# Altium project STSPIN32F0A_ESC.PrjPcb
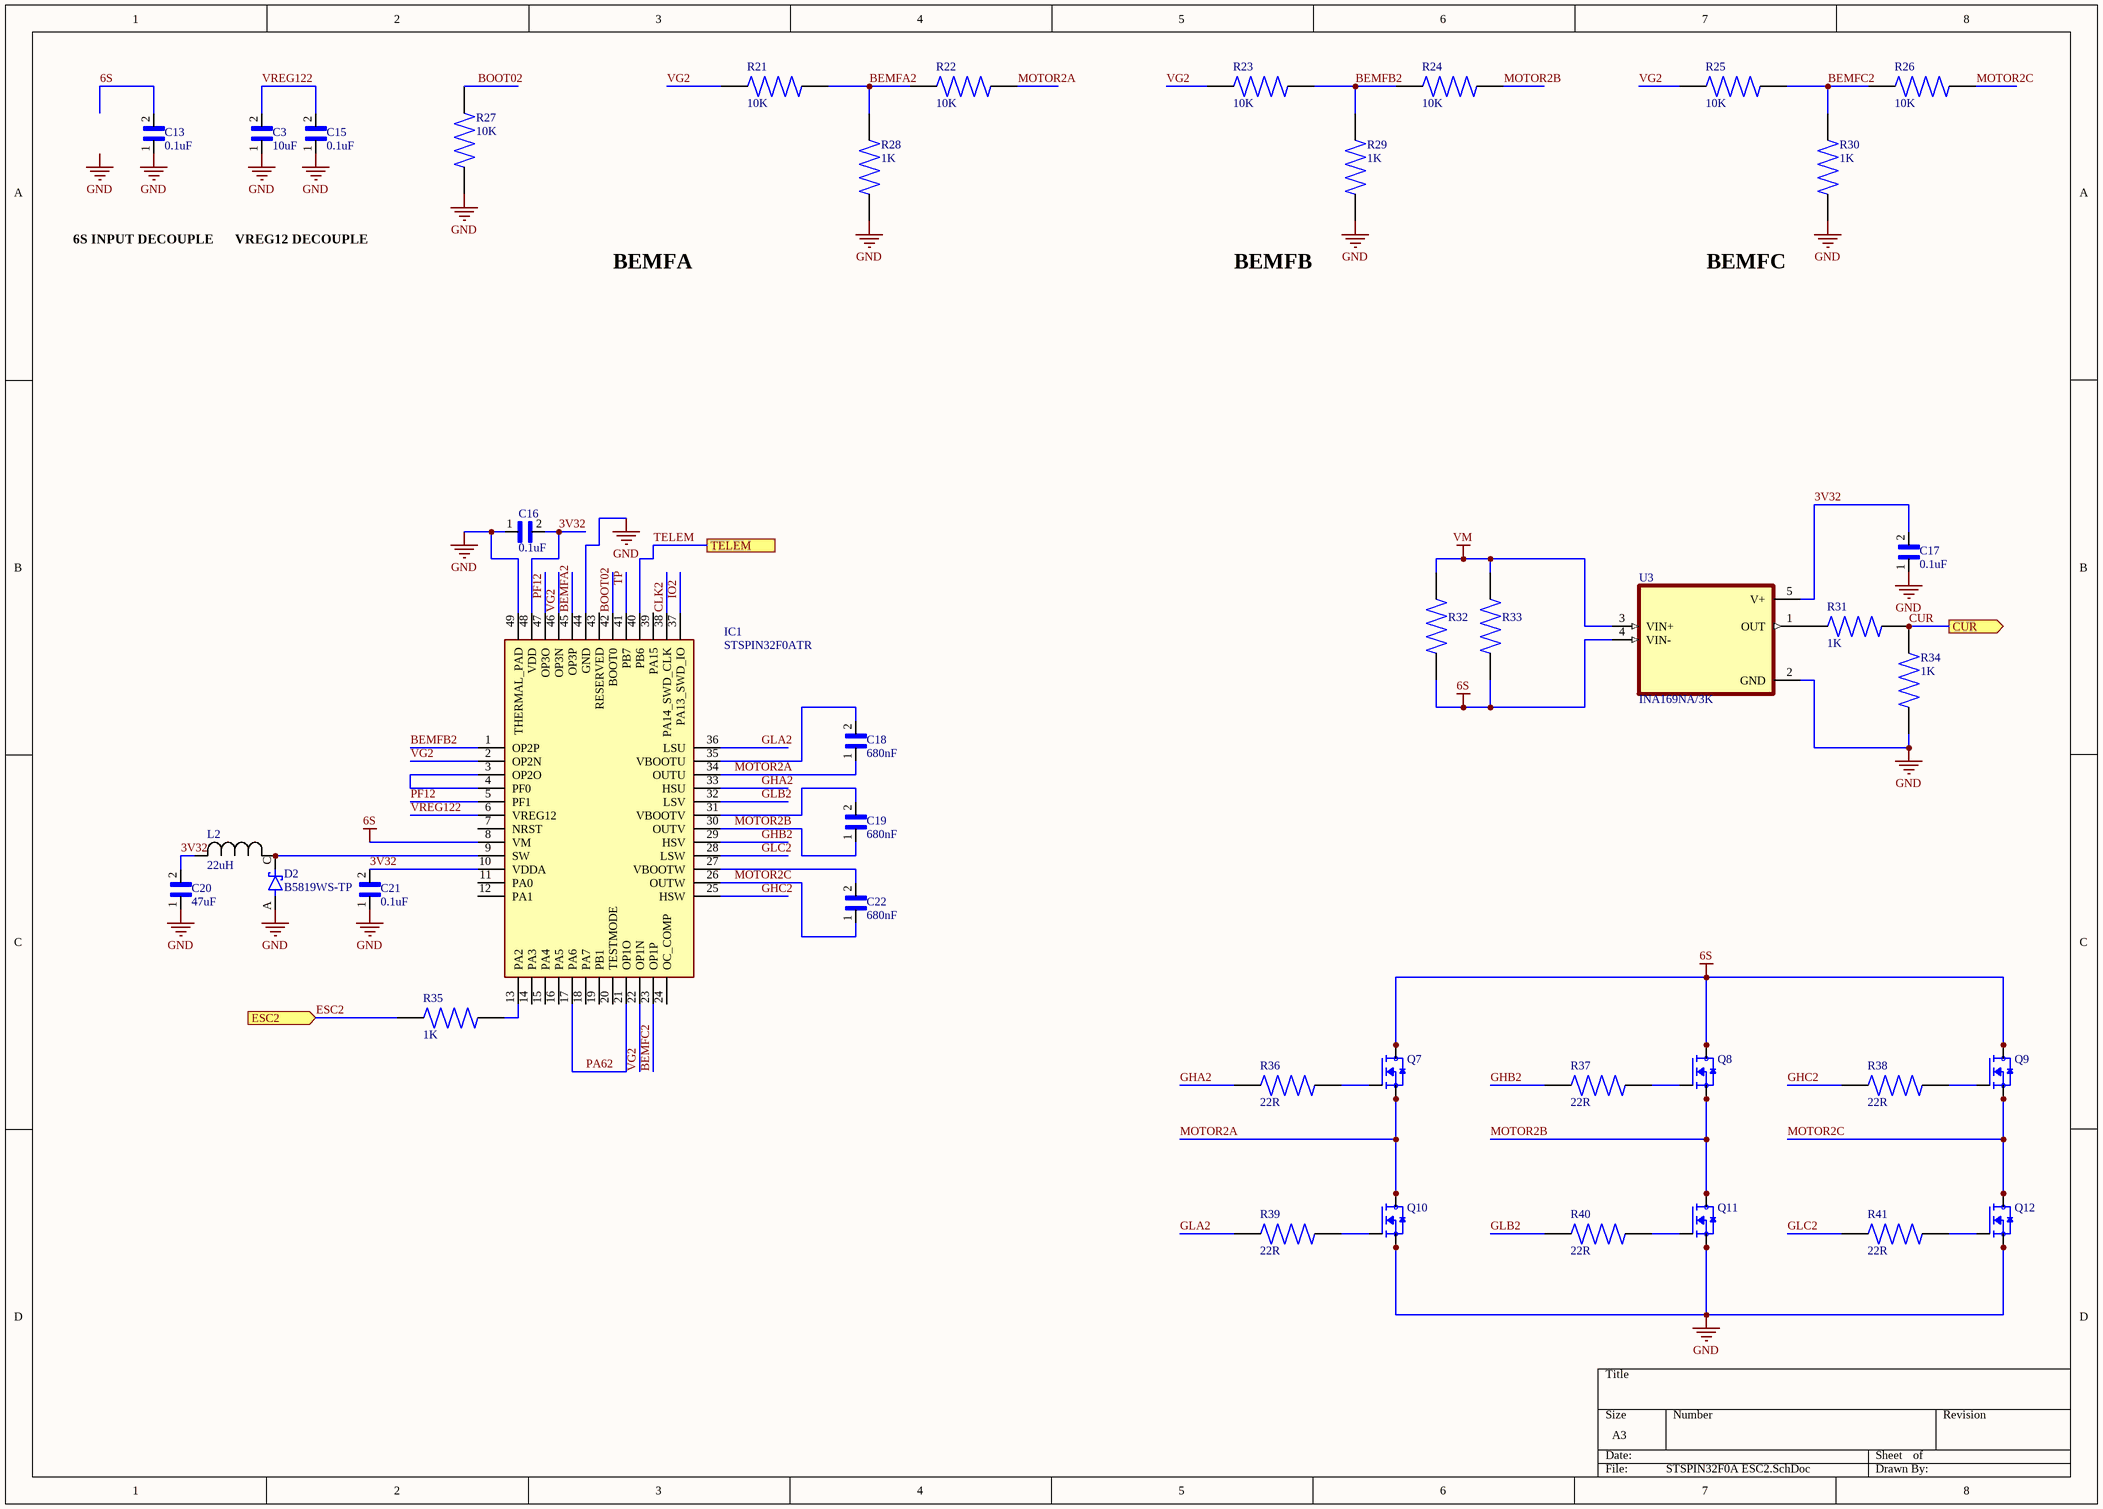
[diagram p0: STSPIN32F0A ESC2.SchDoc]
4 sheets, 168 parts. Net scope: flat (ports and power ports of the same name join across sheets).
Board files: STSPIN 4 IN 1 ESC.PcbDoc, ESC ITERATION 2.PcbDoc
Sheets:
  STSPIN32F0A ESC2.SchDoc
  STSPIN32F0A ESC3.SchDoc
  STSPIN32F0A ESC4.SchDoc
  STSPIN32F0A ESC5.SchDoc

## Sheet STSPIN32F0A ESC2.SchDoc
size A3

### Parts
C3  10uF  [CAPC1608X90N]
C13  0.1uF  [CAPC1005X55N]
C15  0.1uF  [CAPC1005X55N]
C16  0.1uF  [CAPC1005X55N]
C17  0.1uF  [CAPC1005X55N]
C18  680nF  [CAPC1005X55N]
C19  680nF  [CAPC1005X55N]
C20  47uF  [CAPC1608X90N]
C21  0.1uF  [CAPC1005X55N]
C22  680nF  [CAPC1005X55N]
D2  B5819WS-TP  [SOD2512X115N]
IC1  STSPIN32F0ATR  [QFN50P700X700X100-49N-D]
L2  22uH  [IND_BOURNS_SRN3015]
Q7  TPHR8504PL,L1Q  [TRANS_TPHR8504PL,L1Q]  (value not drawn)
Q8  TPHR8504PL,L1Q  [TRANS_TPHR8504PL,L1Q]  (value not drawn)
Q9  TPHR8504PL,L1Q  [TRANS_TPHR8504PL,L1Q]  (value not drawn)
Q10  TPHR8504PL,L1Q  [TRANS_TPHR8504PL,L1Q]  (value not drawn)
Q11  TPHR8504PL,L1Q  [TRANS_TPHR8504PL,L1Q]  (value not drawn)
Q12  TPHR8504PL,L1Q  [TRANS_TPHR8504PL,L1Q]  (value not drawn)
R21  10K  [RESC1005X37N]
R22  10K  [RESC1005X37N]
R23  10K  [RESC1005X37N]
R24  10K  [RESC1005X37N]
R25  10K  [RESC1005X37N]
R26  10K  [RESC1005X37N]
R27  10K  [RESC1005X37N]
R28  1K  [RESC1005X37N]
R29  1K  [RESC1005X37N]
R30  1K  [RESC1005X37N]
R31  1K  [RESC1005X37N]
R32  CSSH2512JTL500  [RESC6232X104N]  (value not drawn)
R33  CSSH2512JTL500  [RESC6232X104N]  (value not drawn)
R34  1K  [RESC1005X37N]
R35  1K  [RESC1005X37N]
R36  22R  [RESC1005X37N]
R37  22R  [RESC1005X37N]
R38  22R  [RESC1005X37N]
R39  22R  [RESC1005X37N]
R40  22R  [RESC1005X37N]
R41  22R  [RESC1005X37N]
U3  INA169NA/3K  [SOT95P280X145-5N]

### Ports
CUR (out), ESC2 (in), TELEM

### Nets
6S: C13.2 IC1.8(VM) Q7.5(D) Q7.6(D) Q7.7(D) Q7.8(D) Q7.9(D) Q8.5(D) Q8.6(D) Q8.7(D) Q8.8(D) Q8.9(D) Q9.5(D) Q9.6(D) Q9.7(D) Q9.8(D) Q9.9(D) R32.2 R33.2 U3.4(VIN-)
GND: C3.1 C13.1 C15.1 C16.1 C17.1 C20.1 C21.1 D2.A IC1.44(GND) IC1.49(THERMAL_PAD) Q10.1(S) Q10.2(S) Q10.3(S) Q11.1(S) Q11.2(S) Q11.3(S) Q12.1(S) Q12.2(S) Q12.3(S) R27.1 R28.2 R29.2 R30.2 R34.2 U3.2(GND)
VM: R32.1 R33.1 U3.3(VIN+)
3V32: C16.2 C17.2 C20.2 C21.2 IC1.10(VDDA) IC1.48(VDD) L2.2 U3.5(V+)
BEMFA2: IC1.45(OP3P) R21.1 R22.2 R28.1
BEMFB2: IC1.1(OP2P) R23.1 R24.2 R29.1
BEMFC2: IC1.23(OP1P) R25.1 R26.2 R30.1
BOOT02: IC1.42(BOOT0) R27.2
CLK2: IC1.38(PA14_SWD_CLK)
CUR: R31.2 R34.1 ; port CUR
ESC2: R35.1 ; port ESC2
GHA2: IC1.33(HSU) R36.2
GHB2: IC1.29(HSV) R37.2
GHC2: IC1.25(HSW) R38.2
GLA2: IC1.36(LSU) R39.2
GLB2: IC1.32(LSV) R40.2
GLC2: IC1.28(LSW) R41.2
IO2: IC1.37(PA13_SWD_IO)
MOTOR2A: C18.1 IC1.34(OUTU) Q7.1(S) Q7.2(S) Q7.3(S) Q10.5(D) Q10.6(D) Q10.7(D) Q10.8(D) Q10.9(D) R22.1
MOTOR2B: C19.1 IC1.30(OUTV) Q8.1(S) Q8.2(S) Q8.3(S) Q11.5(D) Q11.6(D) Q11.7(D) Q11.8(D) Q11.9(D) R24.1
MOTOR2C: C22.1 IC1.26(OUTW) Q9.1(S) Q9.2(S) Q9.3(S) Q12.5(D) Q12.6(D) Q12.7(D) Q12.8(D) Q12.9(D) R26.1
PA62: IC1.17(PA6) IC1.21(OP1O)
PF12: IC1.5(PF1) IC1.47(OP3O)
TELEM: IC1.40(PB6) ; port TELEM
TP: IC1.41(PB7)
VG2: IC1.2(OP2N) IC1.22(OP1N) IC1.46(OP3N) R21.2 R23.2 R25.2
VREG122: C3.2 C15.2 IC1.6(VREG12)
NetC18_2: C18.2 IC1.35(VBOOTU)
NetC19_2: C19.2 IC1.31(VBOOTV)
NetC22_2: C22.2 IC1.27(VBOOTW)
NetD2_C: D2.C(K) IC1.9(SW) L2.1
NetIC1_3: IC1.3(OP2O) IC1.4(PF0)
NetIC1_13: IC1.13(PA2) R35.2
NetQ7_4: Q7.4(G) R36.1
NetQ8_4: Q8.4(G) R37.1
NetQ9_4: Q9.4(G) R38.1
NetQ10_4: Q10.4(G) R39.1
NetQ11_4: Q11.4(G) R40.1
NetQ12_4: Q12.4(G) R41.1
NetR31_1: R31.1 U3.1(OUT)

Not connected (* = marked no-connect by the designer): IC1 7(NRST) 11(PA0) 12(PA1) 14(PA3) 15(PA4) 16(PA5) 18(PA7) 19(PB1) 20(TESTMODE) 24(OC_COMP) 39(PA15) 43(RESERVED)

### Notes on the sheet
- 6S INPUT DECOUPLE
- VREG12 DECOUPLE
- BEMFA
- BEMFB
- BEMFC
- Labels drawn without touching a wire or pin: GND

### Library data of the parts
C3 C20 = GRM188R71E224JA88D: SMD Capacitor X7R(EIA) with Capacitance: 0.22uF Tol. 5%. Rated Voltage: 25Vdc; Package: None; Price: None; Value: *; MP: GRM188R71E224JA88D; Availability: Unavailable
C13 C15-C19 C21 C22 = GRM1555C1H222JA01D: Package: None; Price: None; Value: *; MP: GRM1555C1H222JA01D; Availability: Unavailable
D2 = B5819WS-TP: MF: {'manufacturer': u'Micro Commercial Components'}; Package: None; MP: B5819WS-TP; Price: None; Availability: Unavailable; Value: *
IC1 = STSPIN32F0ATR: Integrated Circuit; Manufacturer_Name: STMicroelectronics; Datasheet Link: http://www.st.com/content/ccc/resource/technical/document/datasheet/group3/3d/88/0f/d1/3f/0c/49/80/DM00406030/files/DM00406030.pdf/jcr:content/translations/en.DM00406030.pdf; Height: 1mm; Manufacturer_Part_Number: STSPIN32F0ATR; Mouser Part Number: 511-STSPIN32F0ATR; Mouser Price/Stock: https://www.mouser.co.uk/ProductDetail/STMicroelectronics/STSPIN32F0ATR?qs=1mbolxNpo8flc7yUpKWOVQ%3D%3D; Arrow Part Number: STSPIN32F0ATR; Arrow Price/Stock: https://www.arrow.com/en/products/stspin32f0atr/stmicroelectronics
L2 = SRN3015-220M: No Description Available; Mfr_Name: Bourns Electronics; Type: DEV; Copyright: Copyright (C) 2022 Ultra Librarian. All rights reserved.; Manufacturer_Part_Number: SRN3015-220M; Digi-Key_Part_Number_1: SRN3015-220MCT-ND; Digi-Key_Part_Number_2: SRN3015-220MDKR-ND; Digi-Key_Part_Number_3: SRN3015-220MTR-ND; RefDes: RefDes
Q7-Q12 = TPHR8504PL,L1Q: N-Channel 40V 150A (Tc) 1W (Ta), 170W (Tc) Surface Mount 8-SOP Advance (5x5); MF: Toshiba Semiconductor; Package: SOP-8 Toshiba; Price: None; Value: *; MP: TPHR8504PL,L1Q; SnapEDA_Link: https://www.snapeda.com/parts/TPHR8504PL,L1Q/Toshiba%20Semiconductor%20and%20Storage/view-part/604439/?ref=snap; Availability: Unavailable
R21-R31 R34-R41 = RE0402BRE07330KL: MF: {'manufacturer': u'Yageo'}; Availability: Unavailable; Package: None; MP: RE0402BRE07330KL; Value: *; Price: None
R32 R33 = CSSH2512JTL500: MF: {'manufacturer': u'Stackpole Electronics Inc'}; Price: None; MP: CSSH2512JTL500; Package: None; Value: *; Availability: Unavailable
U3 = INA169NA/3K: MF: {'manufacturer': u'Texas Instruments'}; Availability: Unavailable; MP: INA169NA/3K; Value: *; Package: None; Price: None

## Sheet STSPIN32F0A ESC3.SchDoc
size A3
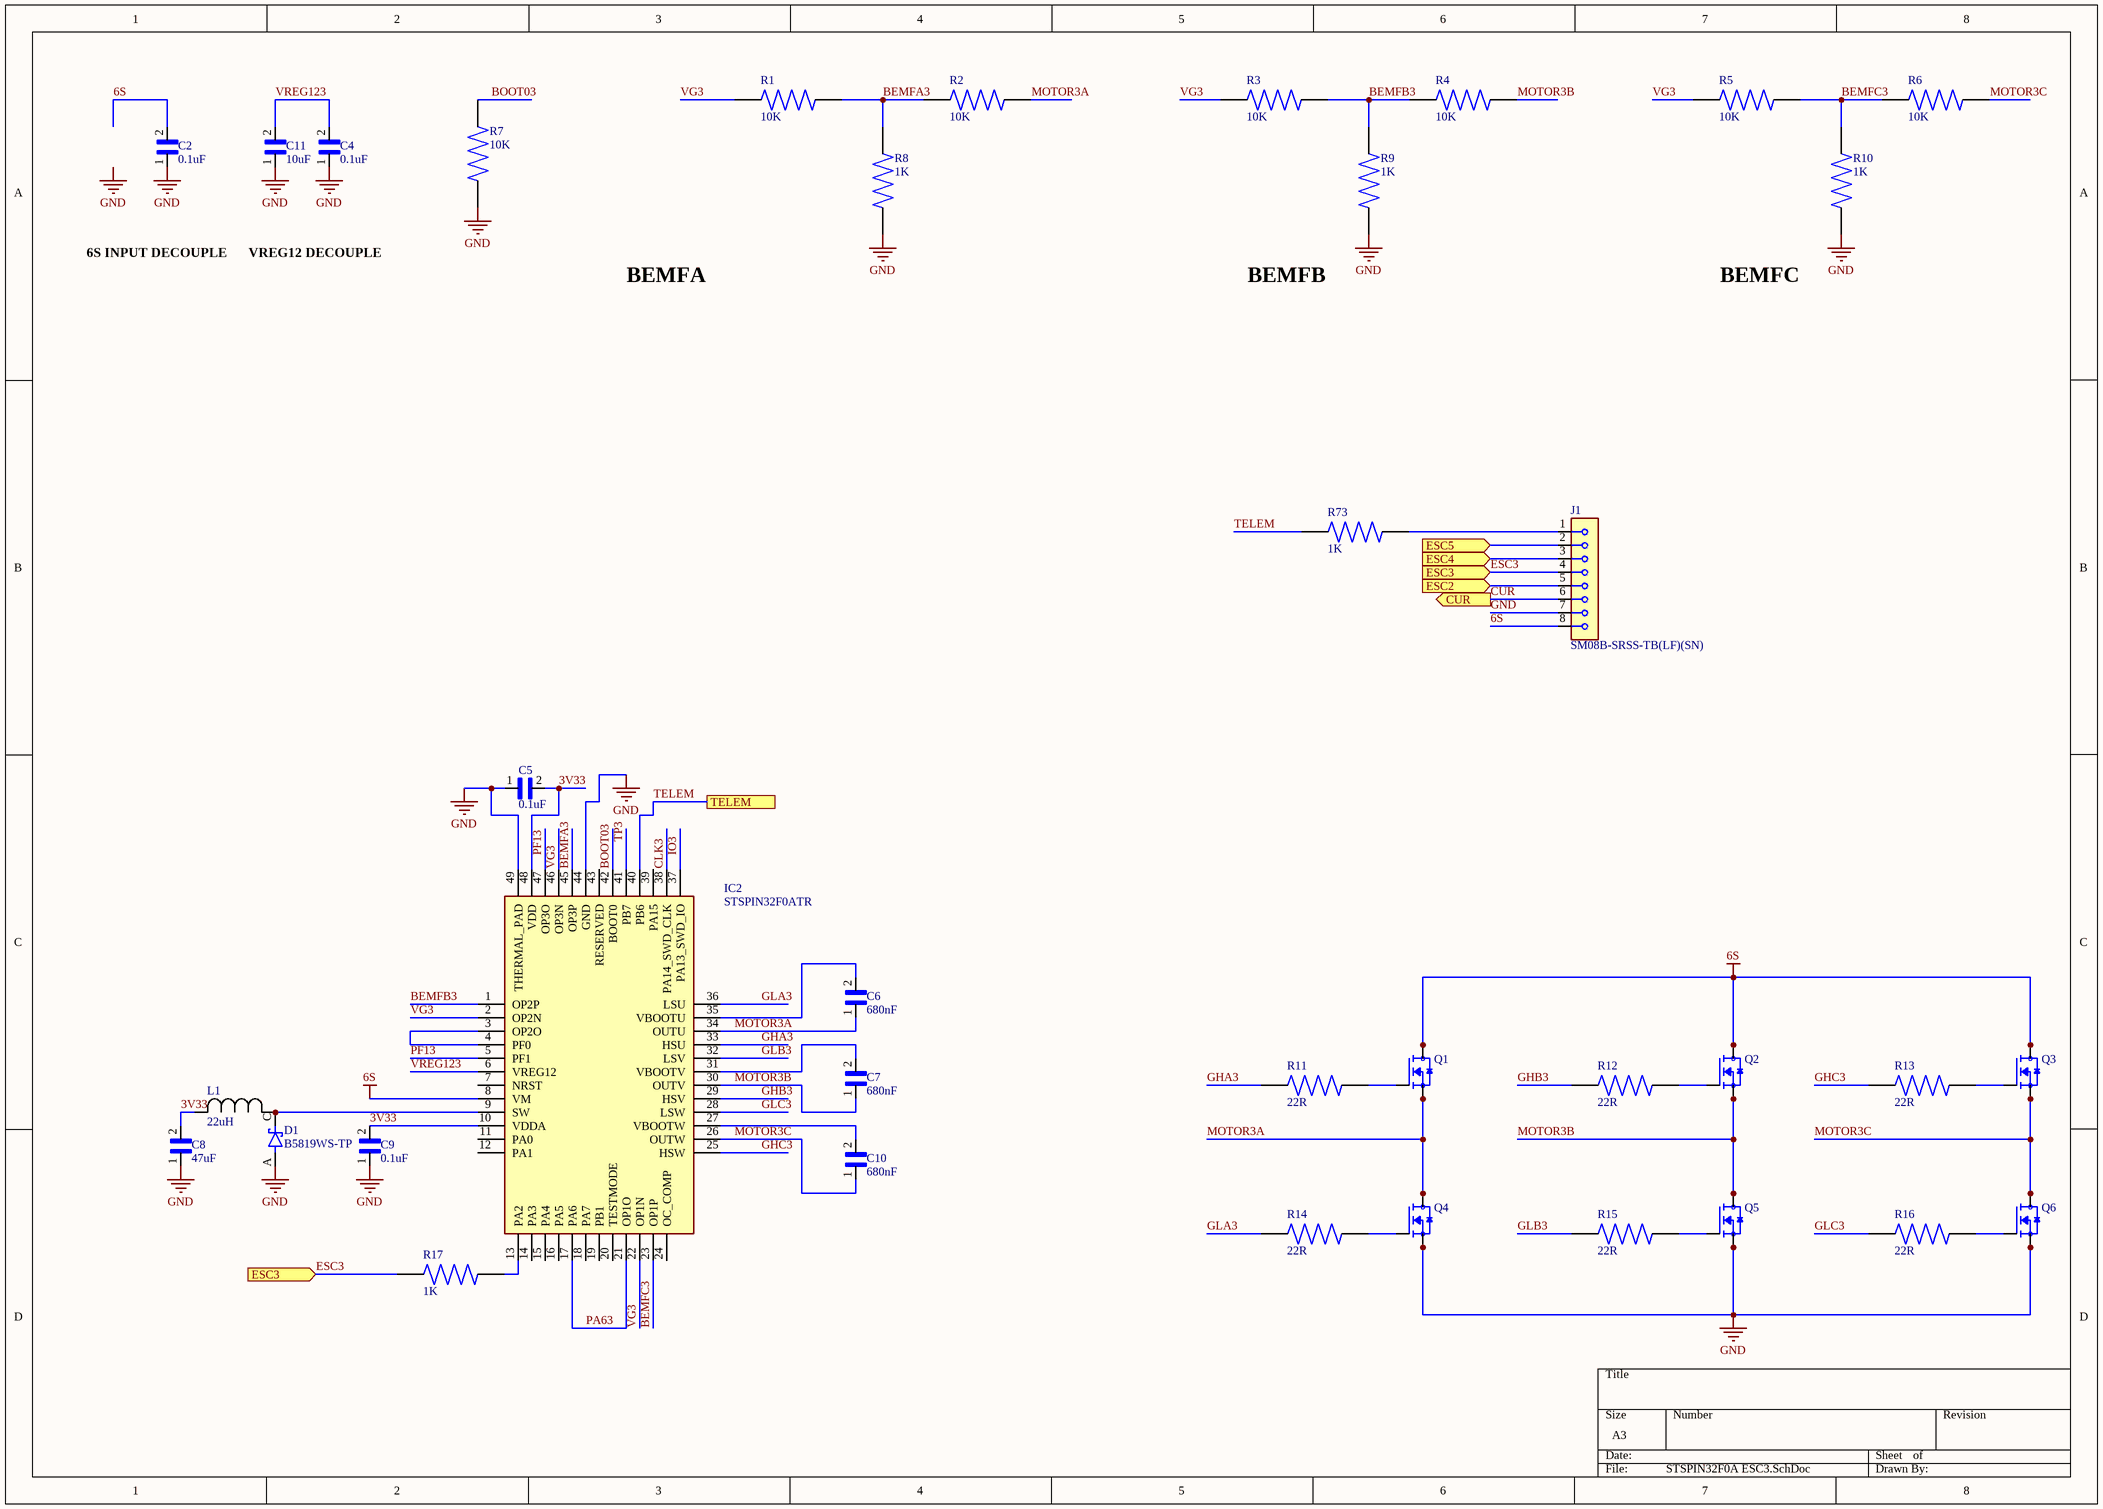
[diagram p1: STSPIN32F0A ESC3.SchDoc]

### Parts
C2  0.1uF  [CAPC1005X55N]
C4  0.1uF  [CAPC1005X55N]
C5  0.1uF  [CAPC1005X55N]
C6  680nF  [CAPC1005X55N]
C7  680nF  [CAPC1005X55N]
C8  47uF  [CAPC1608X90N]
C9  0.1uF  [CAPC1005X55N]
C10  680nF  [CAPC1005X55N]
C11  10uF  [CAPC1608X90N]
D1  B5819WS-TP  [SOD2512X115N]
IC2  STSPIN32F0ATR  [QFN50P700X700X100-49N-D]
J1  SM08B-SRSS-TB(LF)(SN)  [JST_SM08B-SRSS-TB(LF)(SN)]
L1  22uH  [IND_BOURNS_SRN3015]
Q1  TPHR8504PL,L1Q  [TRANS_TPHR8504PL,L1Q]  (value not drawn)
Q2  TPHR8504PL,L1Q  [TRANS_TPHR8504PL,L1Q]  (value not drawn)
Q3  TPHR8504PL,L1Q  [TRANS_TPHR8504PL,L1Q]  (value not drawn)
Q4  TPHR8504PL,L1Q  [TRANS_TPHR8504PL,L1Q]  (value not drawn)
Q5  TPHR8504PL,L1Q  [TRANS_TPHR8504PL,L1Q]  (value not drawn)
Q6  TPHR8504PL,L1Q  [TRANS_TPHR8504PL,L1Q]  (value not drawn)
R1  10K  [RESC1005X37N]
R2  10K  [RESC1005X37N]
R3  10K  [RESC1005X37N]
R4  10K  [RESC1005X37N]
R5  10K  [RESC1005X37N]
R6  10K  [RESC1005X37N]
R7  10K  [RESC1005X37N]
R8  1K  [RESC1005X37N]
R9  1K  [RESC1005X37N]
R10  1K  [RESC1005X37N]
R11  22R  [RESC1005X37N]
R12  22R  [RESC1005X37N]
R13  22R  [RESC1005X37N]
R14  22R  [RESC1005X37N]
R15  22R  [RESC1005X37N]
R16  22R  [RESC1005X37N]
R17  1K  [RESC1005X37N]
R73  1K  [RESC1005X37N]

### Ports
CUR (out), ESC2 (in), ESC3 (in), ESC4 (in), ESC5 (in), TELEM

### Nets
6S: C2.2 IC2.8(VM) J1.8 Q1.5(D) Q1.6(D) Q1.7(D) Q1.8(D) Q1.9(D) Q2.5(D) Q2.6(D) Q2.7(D) Q2.8(D) Q2.9(D) Q3.5(D) Q3.6(D) Q3.7(D) Q3.8(D) Q3.9(D)
GND: C2.1 C4.1 C5.1 C8.1 C9.1 C11.1 D1.A IC2.44(GND) IC2.49(THERMAL_PAD) J1.7 Q4.1(S) Q4.2(S) Q4.3(S) Q5.1(S) Q5.2(S) Q5.3(S) Q6.1(S) Q6.2(S) Q6.3(S) R7.1 R8.2 R9.2 R10.2
3V33: C5.2 C8.2 C9.2 IC2.10(VDDA) IC2.48(VDD) L1.2
BEMFA3: IC2.45(OP3P) R1.1 R2.2 R8.1
BEMFB3: IC2.1(OP2P) R3.1 R4.2 R9.1
BEMFC3: IC2.23(OP1P) R5.1 R6.2 R10.1
BOOT03: IC2.42(BOOT0) R7.2
CLK3: IC2.38(PA14_SWD_CLK)
CUR: J1.6 ; port CUR
ESC2: J1.5 ; port ESC2
ESC3: J1.4 R17.1 ; port ESC3
ESC4: J1.3 ; port ESC4
ESC5: J1.2 ; port ESC5
GHA3: IC2.33(HSU) R11.2
GHB3: IC2.29(HSV) R12.2
GHC3: IC2.25(HSW) R13.2
GLA3: IC2.36(LSU) R14.2
GLB3: IC2.32(LSV) R15.2
GLC3: IC2.28(LSW) R16.2
IO3: IC2.37(PA13_SWD_IO)
MOTOR3A: C6.1 IC2.34(OUTU) Q1.1(S) Q1.2(S) Q1.3(S) Q4.5(D) Q4.6(D) Q4.7(D) Q4.8(D) Q4.9(D) R2.1
MOTOR3B: C7.1 IC2.30(OUTV) Q2.1(S) Q2.2(S) Q2.3(S) Q5.5(D) Q5.6(D) Q5.7(D) Q5.8(D) Q5.9(D) R4.1
MOTOR3C: C10.1 IC2.26(OUTW) Q3.1(S) Q3.2(S) Q3.3(S) Q6.5(D) Q6.6(D) Q6.7(D) Q6.8(D) Q6.9(D) R6.1
PA63: IC2.17(PA6) IC2.21(OP1O)
PF13: IC2.5(PF1) IC2.47(OP3O)
TELEM: IC2.40(PB6) R73.1 ; port TELEM
TP3: IC2.41(PB7)
VG3: IC2.2(OP2N) IC2.22(OP1N) IC2.46(OP3N) R1.2 R3.2 R5.2
VREG123: C4.2 C11.2 IC2.6(VREG12)
NetC6_2: C6.2 IC2.35(VBOOTU)
NetC7_2: C7.2 IC2.31(VBOOTV)
NetC10_2: C10.2 IC2.27(VBOOTW)
NetD1_C: D1.C(K) IC2.9(SW) L1.1
NetIC2_3: IC2.3(OP2O) IC2.4(PF0)
NetIC2_13: IC2.13(PA2) R17.2
NetJ1_1: J1.1 R73.2
NetQ1_4: Q1.4(G) R11.1
NetQ2_4: Q2.4(G) R12.1
NetQ3_4: Q3.4(G) R13.1
NetQ4_4: Q4.4(G) R14.1
NetQ5_4: Q5.4(G) R15.1
NetQ6_4: Q6.4(G) R16.1

Not connected (* = marked no-connect by the designer): IC2 7(NRST) 11(PA0) 12(PA1) 14(PA3) 15(PA4) 16(PA5) 18(PA7) 19(PB1) 20(TESTMODE) 24(OC_COMP) 39(PA15) 43(RESERVED)

### Notes on the sheet
- 6S INPUT DECOUPLE
- VREG12 DECOUPLE
- BEMFA
- BEMFB
- BEMFC
- Labels drawn without touching a wire or pin: GND

### Library data of the parts
C2 C4-C7 C9 C10 = GRM1555C1H222JA01D: Package: None; Price: None; Value: *; MP: GRM1555C1H222JA01D; Availability: Unavailable
C8 C11 = GRM188R71E224JA88D: as C3 on sheet STSPIN32F0A ESC2; Package: None; Price: None; Value: *; MP: GRM188R71E224JA88D; Availability: Unavailable
D1 = B5819WS-TP: as D2 on sheet STSPIN32F0A ESC2; Package: None; MP: B5819WS-TP; Price: None; Availability: Unavailable; Value: *
IC2 = STSPIN32F0ATR: as IC1 on sheet STSPIN32F0A ESC2; Datasheet Link: http://www.st.com/content/ccc/resource/technical/document/datasheet/group3/3d/88/0f/d1/3f/0c/49/80/DM00406030/files/DM00406030.pdf/jcr:content/translations/en.DM00406030.pdf; Height: 1mm; Manufacturer_Part_Number: STSPIN32F0ATR; Mouser Part Number: 511-STSPIN32F0ATR; Mouser Price/Stock: https://www.mouser.co.uk/ProductDetail/STMicroelectronics/STSPIN32F0ATR?qs=1mbolxNpo8flc7yUpKWOVQ%3D%3D; Arrow Part Number: STSPIN32F0ATR; Arrow Price/Stock: https://www.arrow.com/en/products/stspin32f0atr/stmicroelectronics
J1 = SM08B-SRSS-TB(LF)(SN): SH Series 8 Position 1 mm Pitch Surface Mount Side Entry Shrouded Header; Price: None; MP: SM08B-SRSS-TB(LF)(SN); Availability: Unavailable; Value: *; Package: None
L1 = SRN3015-220M: as L2 on sheet STSPIN32F0A ESC2; Copyright: Copyright (C) 2022 Ultra Librarian. All rights reserved.; Manufacturer_Part_Number: SRN3015-220M; Digi-Key_Part_Number_1: SRN3015-220MCT-ND; Digi-Key_Part_Number_2: SRN3015-220MDKR-ND; Digi-Key_Part_Number_3: SRN3015-220MTR-ND; RefDes: RefDes
Q1-Q6 = TPHR8504PL,L1Q: as Q7 on sheet STSPIN32F0A ESC2; Package: SOP-8 Toshiba; Price: None; Value: *; MP: TPHR8504PL,L1Q; SnapEDA_Link: https://www.snapeda.com/parts/TPHR8504PL,L1Q/Toshiba%20Semiconductor%20and%20Storage/view-part/604439/?ref=snap; Availability: Unavailable
R1-R17 R73 = RE0402BRE07330KL: MF: {'manufacturer': u'Yageo'}; Availability: Unavailable; Package: None; MP: RE0402BRE07330KL; Value: *; Price: None

## Sheet STSPIN32F0A ESC4.SchDoc
size A3
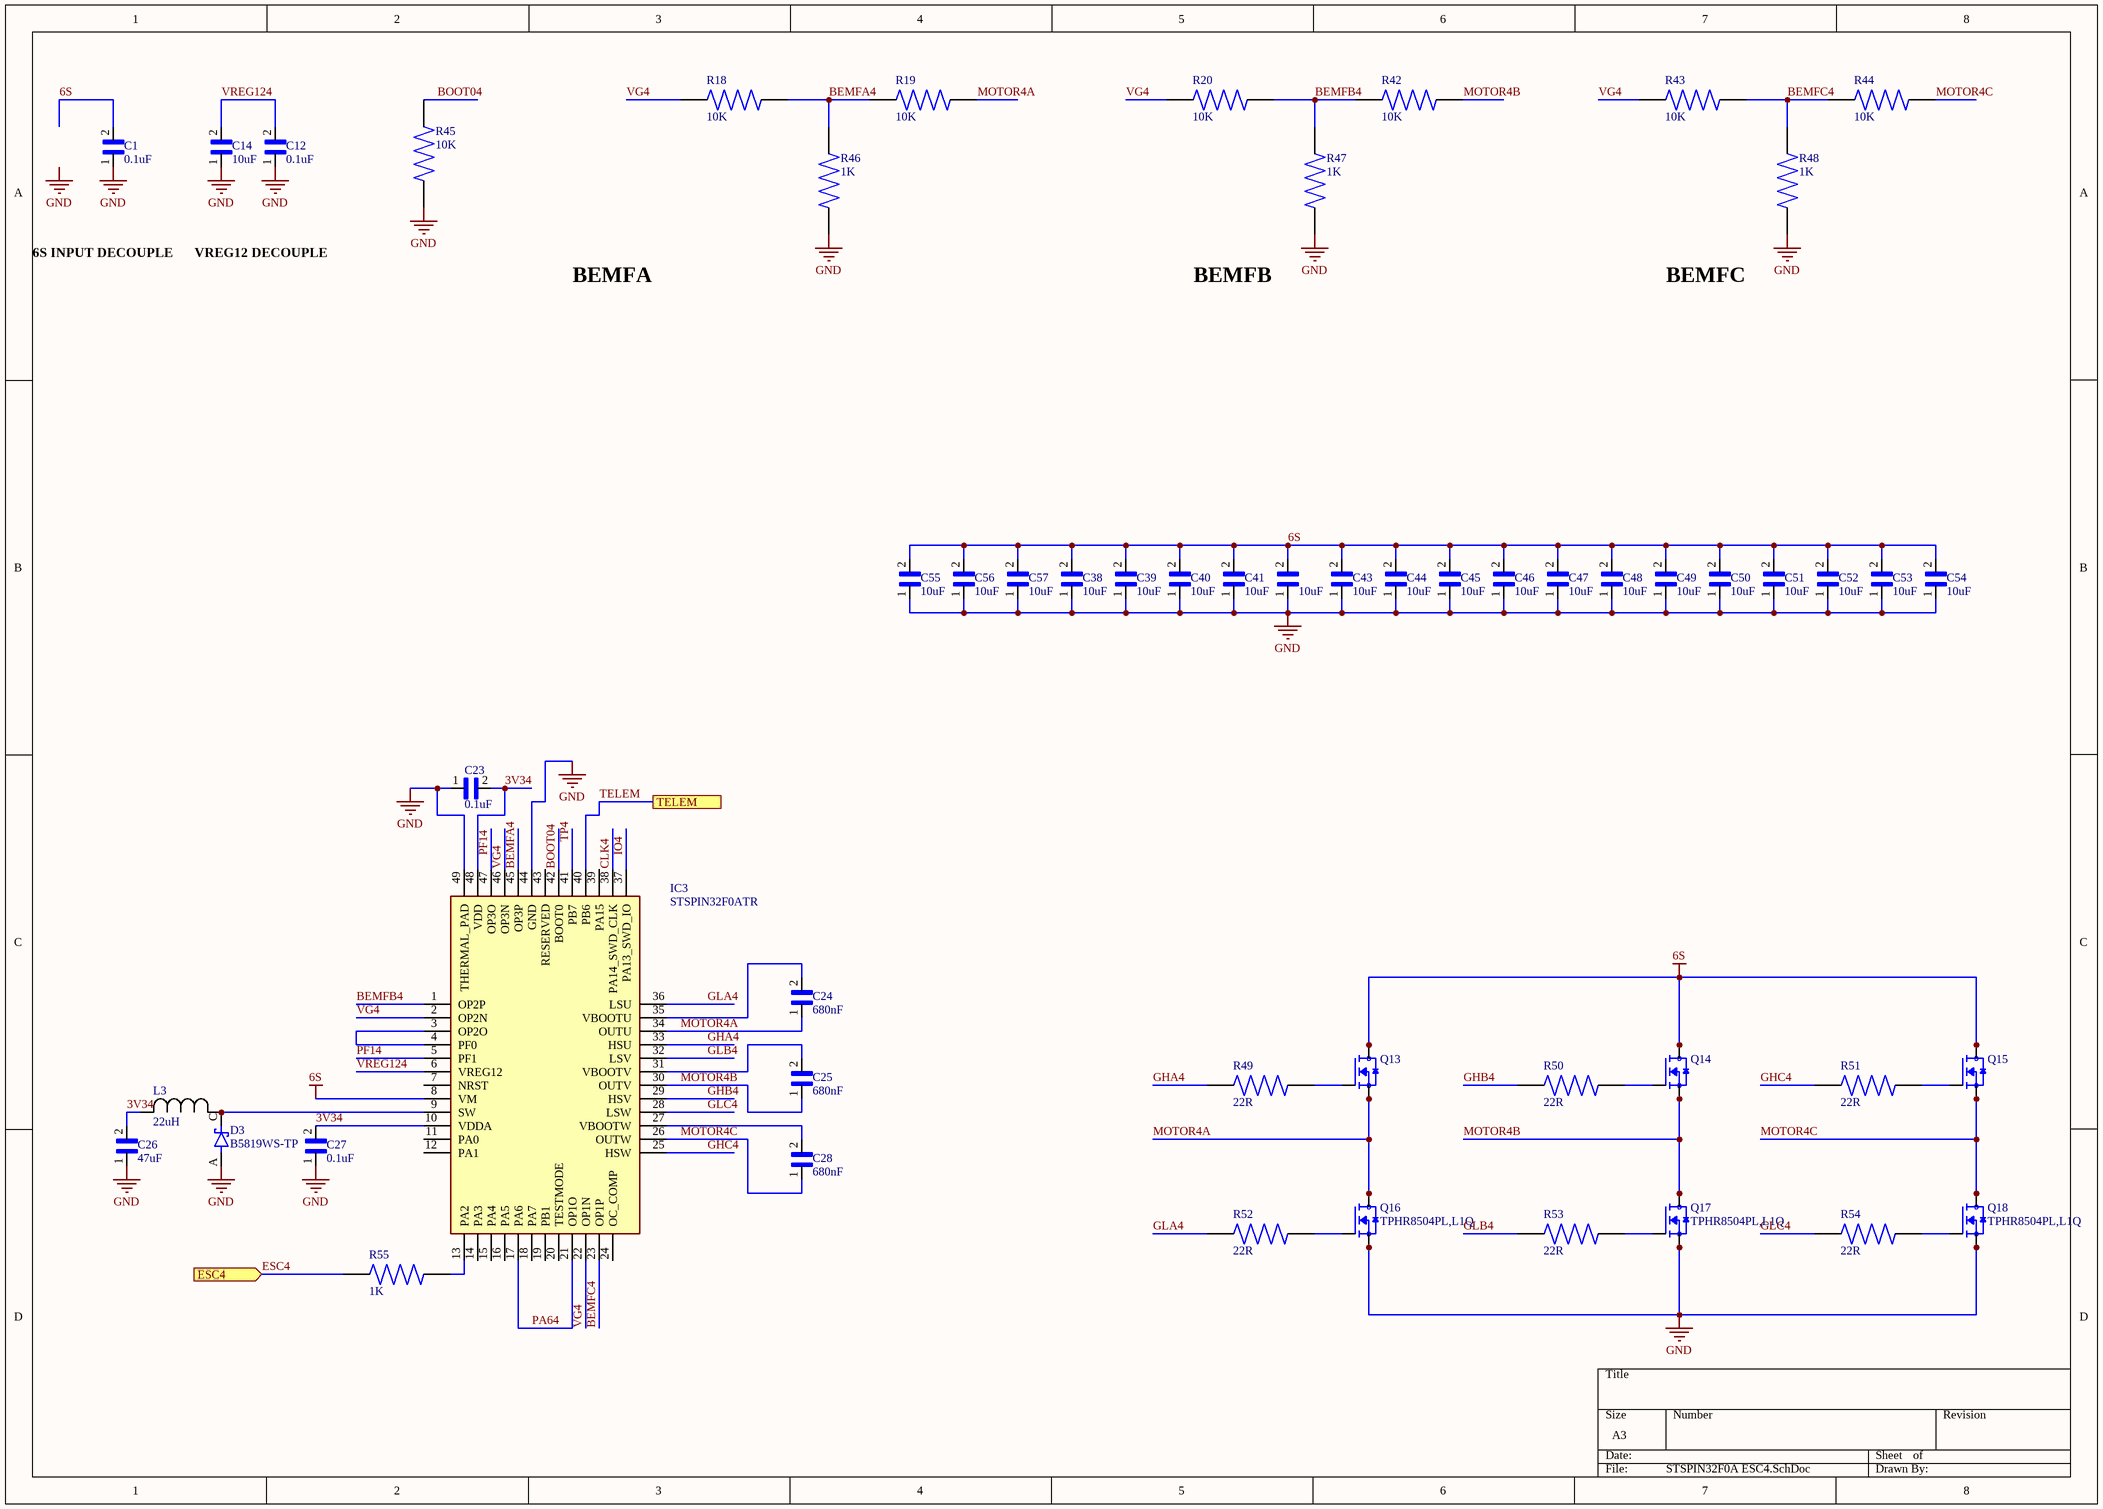
[diagram p2: STSPIN32F0A ESC4.SchDoc]

### Parts
C1  0.1uF  [CAPC1005X55N]
C12  0.1uF  [CAPC1005X55N]
C14  10uF  [CAPC1608X90N]
C23  0.1uF  [CAPC1005X55N]
C24  680nF  [CAPC1005X55N]
C25  680nF  [CAPC1005X55N]
C26  47uF  [CAPC1608X90N]
C27  0.1uF  [CAPC1005X55N]
C28  680nF  [CAPC1005X55N]
C38  10uF  [CAPC3216X190N]
C39  10uF  [CAPC3216X190N]
C40  10uF  [CAPC3216X190N]
C41  10uF  [CAPC3216X190N]
C42  10uF  [CAPC3216X190N]
C43  10uF  [CAPC3216X190N]
C44  10uF  [CAPC3216X190N]
C45  10uF  [CAPC3216X190N]
C46  10uF  [CAPC3216X190N]
C47  10uF  [CAPC3216X190N]
C48  10uF  [CAPC3216X190N]
C49  10uF  [CAPC3216X190N]
C50  10uF  [CAPC3216X190N]
C51  10uF  [CAPC3216X190N]
C52  10uF  [CAPC3216X190N]
C53  10uF  [CAPC3216X190N]
C54  10uF  [CAPC3216X190N]
C55  10uF  [CAPC3216X190N]
C56  10uF  [CAPC3216X190N]
C57  10uF  [CAPC3216X190N]
D3  B5819WS-TP  [SOD2512X115N]
IC3  STSPIN32F0ATR  [QFN50P700X700X100-49N-D]
L3  22uH  [IND_BOURNS_SRN3015]
Q13  TPHR8504PL,L1Q  [TRANS_TPHR8504PL,L1Q]  (value not drawn)
Q14  TPHR8504PL,L1Q  [TRANS_TPHR8504PL,L1Q]  (value not drawn)
Q15  TPHR8504PL,L1Q  [TRANS_TPHR8504PL,L1Q]  (value not drawn)
Q16  TPHR8504PL,L1Q  [TRANS_TPHR8504PL,L1Q]
Q17  TPHR8504PL,L1Q  [TRANS_TPHR8504PL,L1Q]
Q18  TPHR8504PL,L1Q  [TRANS_TPHR8504PL,L1Q]
R18  10K  [RESC1005X37N]
R19  10K  [RESC1005X37N]
R20  10K  [RESC1005X37N]
R42  10K  [RESC1005X37N]
R43  10K  [RESC1005X37N]
R44  10K  [RESC1005X37N]
R45  10K  [RESC1005X37N]
R46  1K  [RESC1005X37N]
R47  1K  [RESC1005X37N]
R48  1K  [RESC1005X37N]
R49  22R  [RESC1005X37N]
R50  22R  [RESC1005X37N]
R51  22R  [RESC1005X37N]
R52  22R  [RESC1005X37N]
R53  22R  [RESC1005X37N]
R54  22R  [RESC1005X37N]
R55  1K  [RESC1005X37N]

### Ports
ESC4 (in), TELEM

### Nets
6S: C1.2 C38.2 C39.2 C40.2 C41.2 C42.2 C43.2 C44.2 C45.2 C46.2 C47.2 C48.2 C49.2 C50.2 C51.2 C52.2 C53.2 C54.2 C55.2 C56.2 C57.2 IC3.8(VM) Q13.5(D) Q13.6(D) Q13.7(D) Q13.8(D) Q13.9(D) Q14.5(D) Q14.6(D) Q14.7(D) Q14.8(D) Q14.9(D) Q15.5(D) Q15.6(D) Q15.7(D) Q15.8(D) Q15.9(D)
GND: C1.1 C12.1 C14.1 C23.1 C26.1 C27.1 C38.1 C39.1 C40.1 C41.1 C42.1 C43.1 C44.1 C45.1 C46.1 C47.1 C48.1 C49.1 C50.1 C51.1 C52.1 C53.1 C54.1 C55.1 C56.1 C57.1 D3.A IC3.44(GND) IC3.49(THERMAL_PAD) Q16.1(S) Q16.2(S) Q16.3(S) Q17.1(S) Q17.2(S) Q17.3(S) Q18.1(S) Q18.2(S) Q18.3(S) R45.1 R46.2 R47.2 R48.2
3V34: C23.2 C26.2 C27.2 IC3.10(VDDA) IC3.48(VDD) L3.2
BEMFA4: IC3.45(OP3P) R18.1 R19.2 R46.1
BEMFB4: IC3.1(OP2P) R20.1 R42.2 R47.1
BEMFC4: IC3.23(OP1P) R43.1 R44.2 R48.1
BOOT04: IC3.42(BOOT0) R45.2
CLK4: IC3.38(PA14_SWD_CLK)
ESC4: R55.1 ; port ESC4
GHA4: IC3.33(HSU) R49.2
GHB4: IC3.29(HSV) R50.2
GHC4: IC3.25(HSW) R51.2
GLA4: IC3.36(LSU) R52.2
GLB4: IC3.32(LSV) R53.2
GLC4: IC3.28(LSW) R54.2
IO4: IC3.37(PA13_SWD_IO)
MOTOR4A: C24.1 IC3.34(OUTU) Q13.1(S) Q13.2(S) Q13.3(S) Q16.5(D) Q16.6(D) Q16.7(D) Q16.8(D) Q16.9(D) R19.1
MOTOR4B: C25.1 IC3.30(OUTV) Q14.1(S) Q14.2(S) Q14.3(S) Q17.5(D) Q17.6(D) Q17.7(D) Q17.8(D) Q17.9(D) R42.1
MOTOR4C: C28.1 IC3.26(OUTW) Q15.1(S) Q15.2(S) Q15.3(S) Q18.5(D) Q18.6(D) Q18.7(D) Q18.8(D) Q18.9(D) R44.1
PA64: IC3.17(PA6) IC3.21(OP1O)
PF14: IC3.5(PF1) IC3.47(OP3O)
TELEM: IC3.40(PB6) ; port TELEM
TP4: IC3.41(PB7)
VG4: IC3.2(OP2N) IC3.22(OP1N) IC3.46(OP3N) R18.2 R20.2 R43.2
VREG124: C12.2 C14.2 IC3.6(VREG12)
NetC24_2: C24.2 IC3.35(VBOOTU)
NetC25_2: C25.2 IC3.31(VBOOTV)
NetC28_2: C28.2 IC3.27(VBOOTW)
NetD3_C: D3.C(K) IC3.9(SW) L3.1
NetIC3_3: IC3.3(OP2O) IC3.4(PF0)
NetIC3_13: IC3.13(PA2) R55.2
NetQ13_4: Q13.4(G) R49.1
NetQ14_4: Q14.4(G) R50.1
NetQ15_4: Q15.4(G) R51.1
NetQ16_4: Q16.4(G) R52.1
NetQ17_4: Q17.4(G) R53.1
NetQ18_4: Q18.4(G) R54.1

Not connected (* = marked no-connect by the designer): IC3 7(NRST) 11(PA0) 12(PA1) 14(PA3) 15(PA4) 16(PA5) 18(PA7) 19(PB1) 20(TESTMODE) 24(OC_COMP) 39(PA15) 43(RESERVED)

### Notes on the sheet
- 6S INPUT DECOUPLE
- VREG12 DECOUPLE
- BEMFA
- BEMFB
- BEMFC
- Labels drawn without touching a wire or pin: GND

### Library data of the parts
C1 C12 C23-C25 C27 C28 = GRM1555C1H222JA01D: Package: None; Price: None; Value: *; MP: GRM1555C1H222JA01D; Availability: Unavailable
C14 C26 = GRM188R71E224JA88D: as C3 on sheet STSPIN32F0A ESC2; Package: None; Price: None; Value: *; MP: GRM188R71E224JA88D; Availability: Unavailable
C38-C57 = GRM31CC80G227ME11K: Ceramic Capacitor; Package: None; Price: None; Value: *; MP: GRM31CC80G227ME11K; Availability: Unavailable
D3 = B5819WS-TP: as D2 on sheet STSPIN32F0A ESC2; Package: None; MP: B5819WS-TP; Price: None; Availability: Unavailable; Value: *
IC3 = STSPIN32F0ATR: as IC1 on sheet STSPIN32F0A ESC2; Datasheet Link: http://www.st.com/content/ccc/resource/technical/document/datasheet/group3/3d/88/0f/d1/3f/0c/49/80/DM00406030/files/DM00406030.pdf/jcr:content/translations/en.DM00406030.pdf; Height: 1mm; Manufacturer_Part_Number: STSPIN32F0ATR; Mouser Part Number: 511-STSPIN32F0ATR; Mouser Price/Stock: https://www.mouser.co.uk/ProductDetail/STMicroelectronics/STSPIN32F0ATR?qs=1mbolxNpo8flc7yUpKWOVQ%3D%3D; Arrow Part Number: STSPIN32F0ATR; Arrow Price/Stock: https://www.arrow.com/en/products/stspin32f0atr/stmicroelectronics
L3 = SRN3015-220M: as L2 on sheet STSPIN32F0A ESC2; Copyright: Copyright (C) 2022 Ultra Librarian. All rights reserved.; Manufacturer_Part_Number: SRN3015-220M; Digi-Key_Part_Number_1: SRN3015-220MCT-ND; Digi-Key_Part_Number_2: SRN3015-220MDKR-ND; Digi-Key_Part_Number_3: SRN3015-220MTR-ND; RefDes: RefDes
Q13-Q18 = TPHR8504PL,L1Q: as Q7 on sheet STSPIN32F0A ESC2; Package: SOP-8 Toshiba; Price: None; Value: *; MP: TPHR8504PL,L1Q; SnapEDA_Link: https://www.snapeda.com/parts/TPHR8504PL,L1Q/Toshiba%20Semiconductor%20and%20Storage/view-part/604439/?ref=snap; Availability: Unavailable
R18-R20 R42-R55 = RE0402BRE07330KL: MF: {'manufacturer': u'Yageo'}; Availability: Unavailable; Package: None; MP: RE0402BRE07330KL; Value: *; Price: None

## Sheet STSPIN32F0A ESC5.SchDoc
size A3
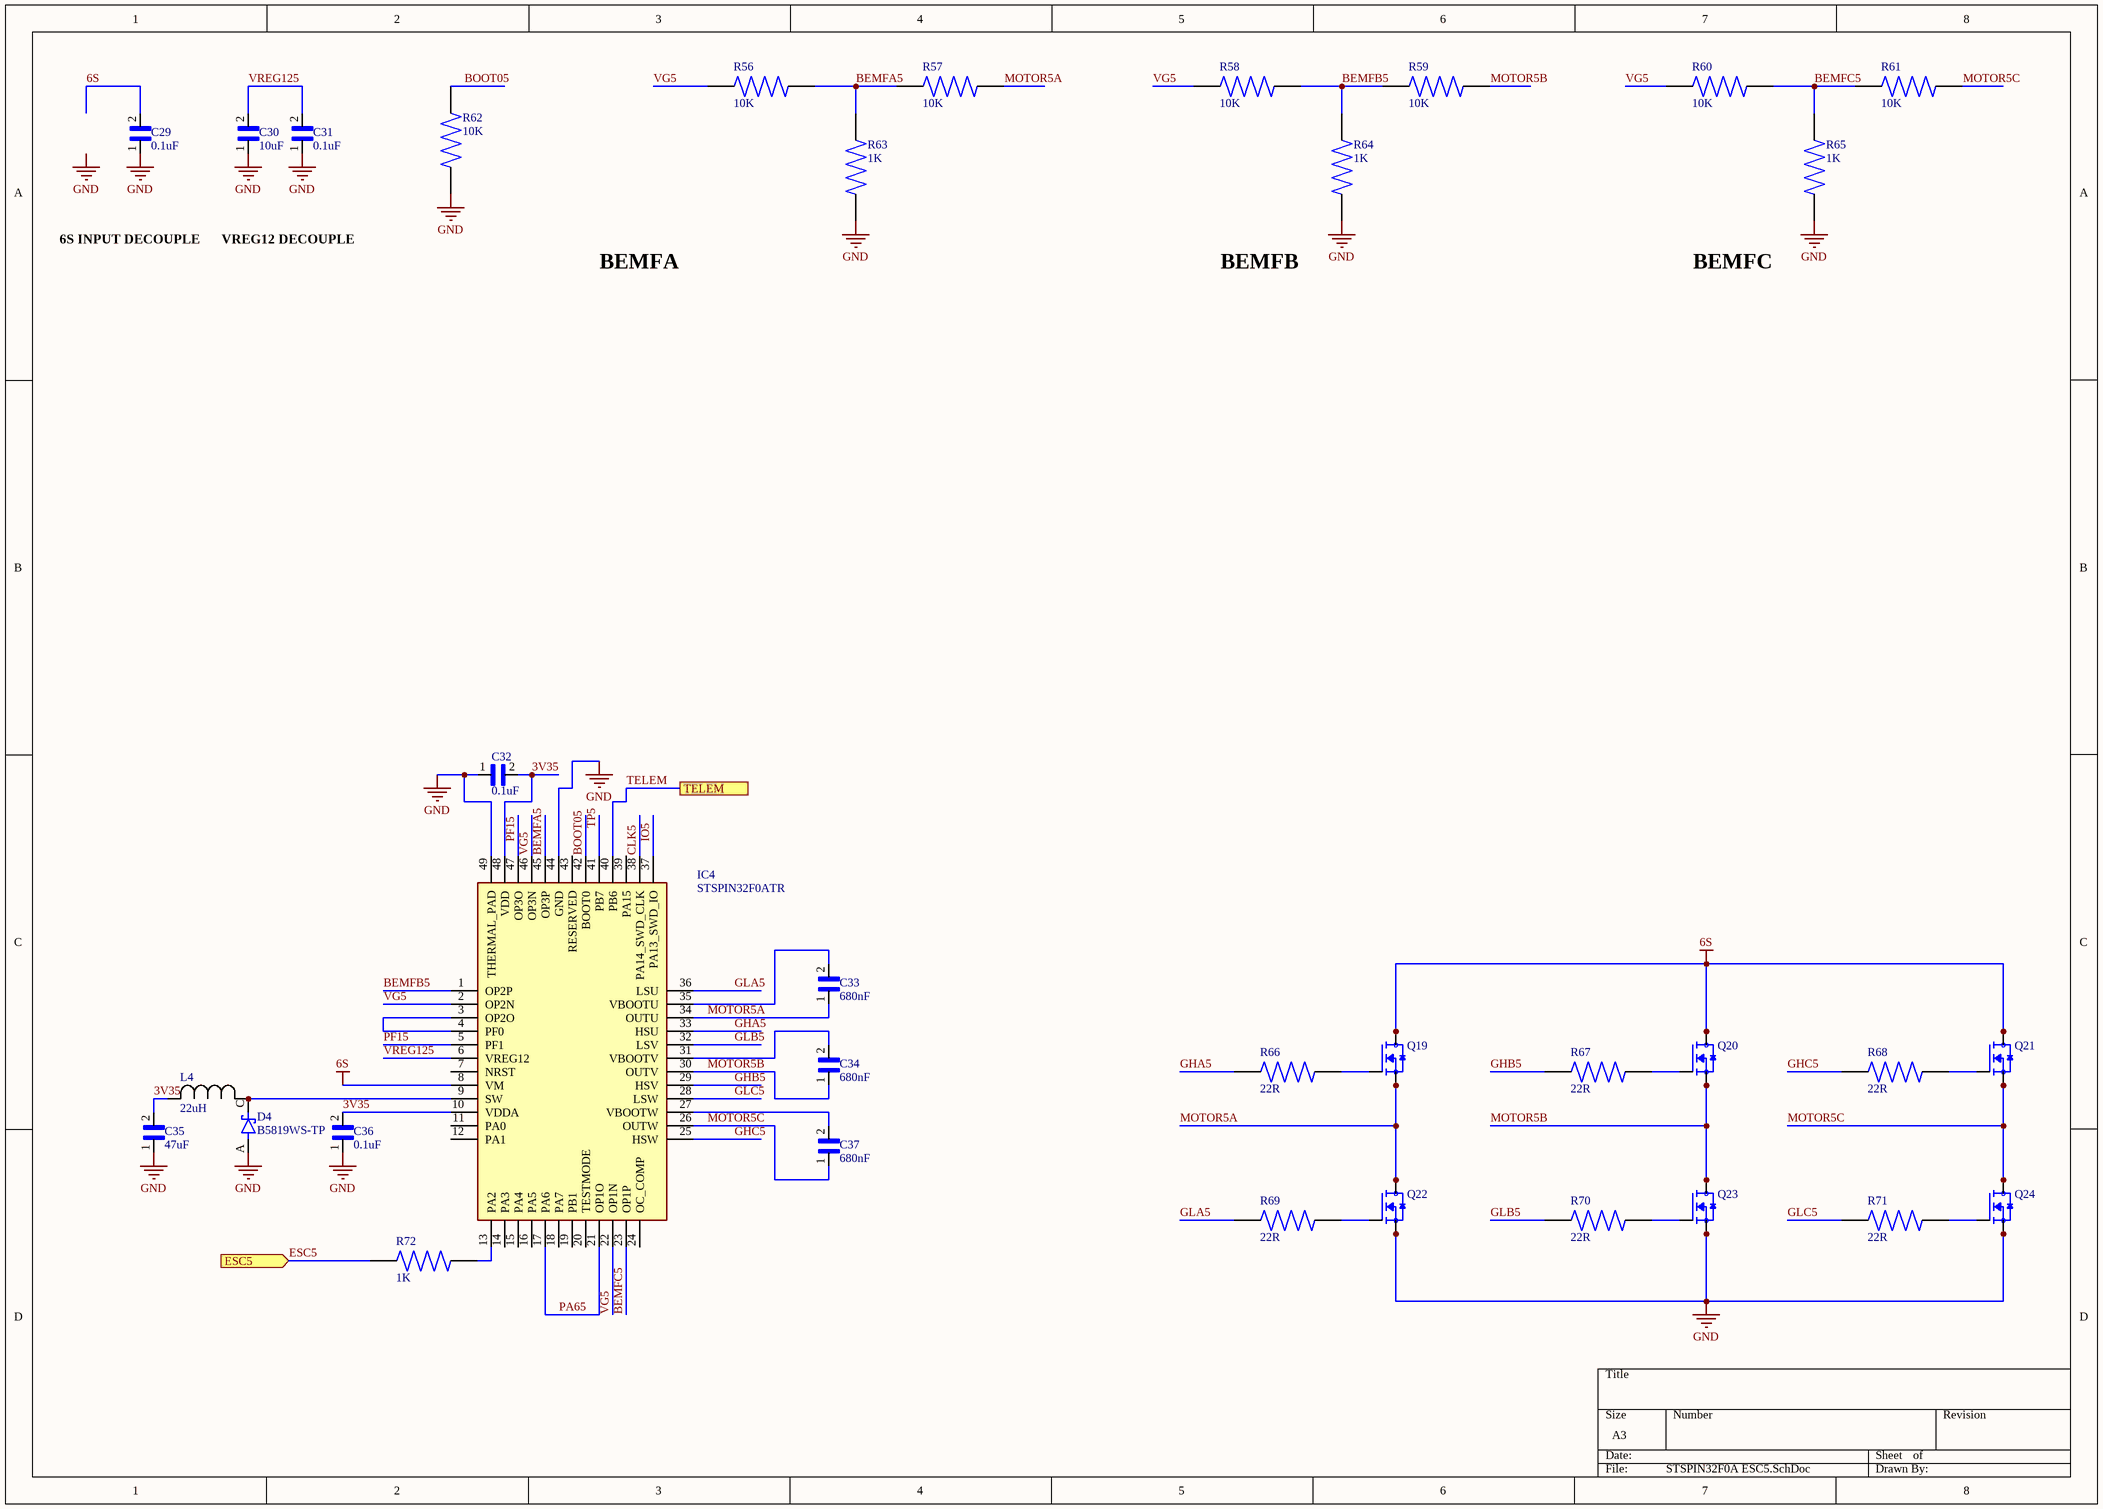
[diagram p3: STSPIN32F0A ESC5.SchDoc]

### Parts
C29  0.1uF  [CAPC1005X55N]
C30  10uF  [CAPC1608X90N]
C31  0.1uF  [CAPC1005X55N]
C32  0.1uF  [CAPC1005X55N]
C33  680nF  [CAPC1005X55N]
C34  680nF  [CAPC1005X55N]
C35  47uF  [CAPC1608X90N]
C36  0.1uF  [CAPC1005X55N]
C37  680nF  [CAPC1005X55N]
D4  B5819WS-TP  [SOD2512X115N]
IC4  STSPIN32F0ATR  [QFN50P700X700X100-49N-D]
L4  22uH  [IND_BOURNS_SRN3015]
Q19  TPHR8504PL,L1Q  [TRANS_TPHR8504PL,L1Q]  (value not drawn)
Q20  TPHR8504PL,L1Q  [TRANS_TPHR8504PL,L1Q]  (value not drawn)
Q21  TPHR8504PL,L1Q  [TRANS_TPHR8504PL,L1Q]  (value not drawn)
Q22  TPHR8504PL,L1Q  [TRANS_TPHR8504PL,L1Q]  (value not drawn)
Q23  TPHR8504PL,L1Q  [TRANS_TPHR8504PL,L1Q]  (value not drawn)
Q24  TPHR8504PL,L1Q  [TRANS_TPHR8504PL,L1Q]  (value not drawn)
R56  10K  [RESC1005X37N]
R57  10K  [RESC1005X37N]
R58  10K  [RESC1005X37N]
R59  10K  [RESC1005X37N]
R60  10K  [RESC1005X37N]
R61  10K  [RESC1005X37N]
R62  10K  [RESC1005X37N]
R63  1K  [RESC1005X37N]
R64  1K  [RESC1005X37N]
R65  1K  [RESC1005X37N]
R66  22R  [RESC1005X37N]
R67  22R  [RESC1005X37N]
R68  22R  [RESC1005X37N]
R69  22R  [RESC1005X37N]
R70  22R  [RESC1005X37N]
R71  22R  [RESC1005X37N]
R72  1K  [RESC1005X37N]

### Ports
ESC5 (in), TELEM

### Nets
6S: C29.2 IC4.8(VM) Q19.5(D) Q19.6(D) Q19.7(D) Q19.8(D) Q19.9(D) Q20.5(D) Q20.6(D) Q20.7(D) Q20.8(D) Q20.9(D) Q21.5(D) Q21.6(D) Q21.7(D) Q21.8(D) Q21.9(D)
GND: C29.1 C30.1 C31.1 C32.1 C35.1 C36.1 D4.A IC4.44(GND) IC4.49(THERMAL_PAD) Q22.1(S) Q22.2(S) Q22.3(S) Q23.1(S) Q23.2(S) Q23.3(S) Q24.1(S) Q24.2(S) Q24.3(S) R62.1 R63.2 R64.2 R65.2
3V35: C32.2 C35.2 C36.2 IC4.10(VDDA) IC4.48(VDD) L4.2
BEMFA5: IC4.45(OP3P) R56.1 R57.2 R63.1
BEMFB5: IC4.1(OP2P) R58.1 R59.2 R64.1
BEMFC5: IC4.23(OP1P) R60.1 R61.2 R65.1
BOOT05: IC4.42(BOOT0) R62.2
CLK5: IC4.38(PA14_SWD_CLK)
ESC5: R72.1 ; port ESC5
GHA5: IC4.33(HSU) R66.2
GHB5: IC4.29(HSV) R67.2
GHC5: IC4.25(HSW) R68.2
GLA5: IC4.36(LSU) R69.2
GLB5: IC4.32(LSV) R70.2
GLC5: IC4.28(LSW) R71.2
IO5: IC4.37(PA13_SWD_IO)
MOTOR5A: C33.1 IC4.34(OUTU) Q19.1(S) Q19.2(S) Q19.3(S) Q22.5(D) Q22.6(D) Q22.7(D) Q22.8(D) Q22.9(D) R57.1
MOTOR5B: C34.1 IC4.30(OUTV) Q20.1(S) Q20.2(S) Q20.3(S) Q23.5(D) Q23.6(D) Q23.7(D) Q23.8(D) Q23.9(D) R59.1
MOTOR5C: C37.1 IC4.26(OUTW) Q21.1(S) Q21.2(S) Q21.3(S) Q24.5(D) Q24.6(D) Q24.7(D) Q24.8(D) Q24.9(D) R61.1
PA65: IC4.17(PA6) IC4.21(OP1O)
PF15: IC4.5(PF1) IC4.47(OP3O)
TELEM: IC4.40(PB6) ; port TELEM
TP5: IC4.41(PB7)
VG5: IC4.2(OP2N) IC4.22(OP1N) IC4.46(OP3N) R56.2 R58.2 R60.2
VREG125: C30.2 C31.2 IC4.6(VREG12)
NetC33_2: C33.2 IC4.35(VBOOTU)
NetC34_2: C34.2 IC4.31(VBOOTV)
NetC37_2: C37.2 IC4.27(VBOOTW)
NetD4_C: D4.C(K) IC4.9(SW) L4.1
NetIC4_3: IC4.3(OP2O) IC4.4(PF0)
NetIC4_13: IC4.13(PA2) R72.2
NetQ19_4: Q19.4(G) R66.1
NetQ20_4: Q20.4(G) R67.1
NetQ21_4: Q21.4(G) R68.1
NetQ22_4: Q22.4(G) R69.1
NetQ23_4: Q23.4(G) R70.1
NetQ24_4: Q24.4(G) R71.1

Not connected (* = marked no-connect by the designer): IC4 7(NRST) 11(PA0) 12(PA1) 14(PA3) 15(PA4) 16(PA5) 18(PA7) 19(PB1) 20(TESTMODE) 24(OC_COMP) 39(PA15) 43(RESERVED)

### Notes on the sheet
- 6S INPUT DECOUPLE
- VREG12 DECOUPLE
- BEMFA
- BEMFB
- BEMFC
- Labels drawn without touching a wire or pin: GND

### Library data of the parts
C29 C31-C34 C36 C37 = GRM1555C1H222JA01D: Package: None; Price: None; Value: *; MP: GRM1555C1H222JA01D; Availability: Unavailable
C30 C35 = GRM188R71E224JA88D: as C3 on sheet STSPIN32F0A ESC2; Package: None; Price: None; Value: *; MP: GRM188R71E224JA88D; Availability: Unavailable
D4 = B5819WS-TP: as D2 on sheet STSPIN32F0A ESC2; Package: None; MP: B5819WS-TP; Price: None; Availability: Unavailable; Value: *
IC4 = STSPIN32F0ATR: as IC1 on sheet STSPIN32F0A ESC2; Datasheet Link: http://www.st.com/content/ccc/resource/technical/document/datasheet/group3/3d/88/0f/d1/3f/0c/49/80/DM00406030/files/DM00406030.pdf/jcr:content/translations/en.DM00406030.pdf; Height: 1mm; Manufacturer_Part_Number: STSPIN32F0ATR; Mouser Part Number: 511-STSPIN32F0ATR; Mouser Price/Stock: https://www.mouser.co.uk/ProductDetail/STMicroelectronics/STSPIN32F0ATR?qs=1mbolxNpo8flc7yUpKWOVQ%3D%3D; Arrow Part Number: STSPIN32F0ATR; Arrow Price/Stock: https://www.arrow.com/en/products/stspin32f0atr/stmicroelectronics
L4 = SRN3015-220M: as L2 on sheet STSPIN32F0A ESC2; Copyright: Copyright (C) 2022 Ultra Librarian. All rights reserved.; Manufacturer_Part_Number: SRN3015-220M; Digi-Key_Part_Number_1: SRN3015-220MCT-ND; Digi-Key_Part_Number_2: SRN3015-220MDKR-ND; Digi-Key_Part_Number_3: SRN3015-220MTR-ND; RefDes: RefDes
Q19-Q24 = TPHR8504PL,L1Q: as Q7 on sheet STSPIN32F0A ESC2; Package: SOP-8 Toshiba; Price: None; Value: *; MP: TPHR8504PL,L1Q; SnapEDA_Link: https://www.snapeda.com/parts/TPHR8504PL,L1Q/Toshiba%20Semiconductor%20and%20Storage/view-part/604439/?ref=snap; Availability: Unavailable
R56-R72 = RE0402BRE07330KL: MF: {'manufacturer': u'Yageo'}; Availability: Unavailable; Package: None; MP: RE0402BRE07330KL; Value: *; Price: None

## Nets that join several sheets
6S: STSPIN32F0A ESC2 (20 pins), STSPIN32F0A ESC3 (18 pins), STSPIN32F0A ESC4 (37 pins), STSPIN32F0A ESC5 (17 pins)
GND: STSPIN32F0A ESC2 (25 pins), STSPIN32F0A ESC3 (23 pins), STSPIN32F0A ESC4 (42 pins), STSPIN32F0A ESC5 (22 pins)
CUR: STSPIN32F0A ESC2 (R31.2 R34.1), STSPIN32F0A ESC3 (J1.6)
ESC2: STSPIN32F0A ESC2 (R35.1), STSPIN32F0A ESC3 (J1.5)
ESC4: STSPIN32F0A ESC3 (J1.3), STSPIN32F0A ESC4 (R55.1)
ESC5: STSPIN32F0A ESC3 (J1.2), STSPIN32F0A ESC5 (R72.1)
TELEM: STSPIN32F0A ESC2 (IC1.40), STSPIN32F0A ESC3 (IC2.40 R73.1), STSPIN32F0A ESC4 (IC3.40), STSPIN32F0A ESC5 (IC4.40)